# EAGLE schematic midi2cv (EAGLE 6.5.0)
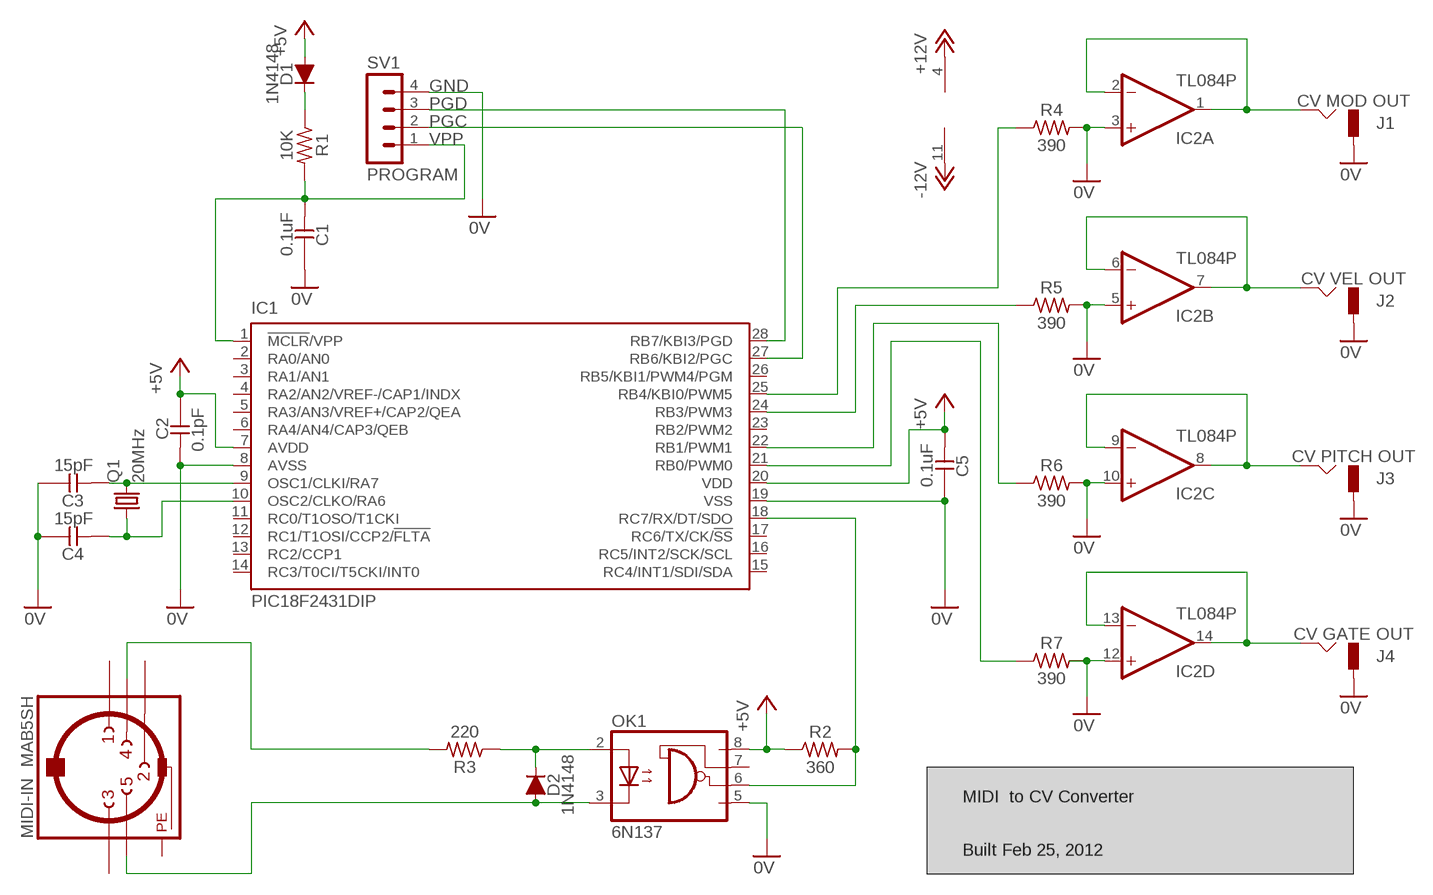
[diagram p0: schematic, sheet 1]

## Parts
C1  0.1uF  CC-US025-024X044  [C025-024X044]
C2  0.1pF  CC-US025-024X044  [C025-024X044]
C3  15pF  CC-US025-024X044  [C025-024X044]
C4  15pF  CC-US025-024X044  [C025-024X044]
C5  0.1uF  CC-US025-024X044  [C025-024X044]
D1  1N4148  [DO35-7]
D2  1N4148  [DO35-7]
IC1  PIC18F2431DIP  [DIL28-3]
IC2  TL084P  [DIL14]
J1  CV MOD OUT  JACK-M  [JACK-M]
J2  CV VEL OUT  JACK-M  [JACK-M]
J3  CV PITCH OUT  JACK-M  [JACK-M]
J4  CV GATE OUT  JACK-M  [JACK-M]
MIDI-IN  MAB5SH  [MAB5SH]
OK1  6N137  [DIL08]
Q1  20MHz  CRYSTALHC49S  [HC49/S]
R1  10K  R0309/10  [0309/10]
R2  360  R0309/10  [0309/10]
R3  220  R0309/10  [0309/10]
R4  390  R0309/10  [0309/10]
R5  390  R0309/10  [0309/10]
R6  390  R0309/10  [0309/10]
R7  390  R0309/10  [0309/10]
SV1  PROGRAM  MA04-1  [MA04-1]

## Nets
0V: C1.1 C2.2 C3.1 C4.1 C5.1 IC1.8(AVSS) IC1.19(VSS) IC2.3(A:+IN) IC2.5(B:+IN) IC2.10(C:+IN) IC2.12(D:+IN) J1.GND J2.GND J3.GND J4.GND OK1.5(GND) R4.2 R5.2 R6.2 R7.2
+5V: C2.1 C5.2 D1.A IC1.7(AVDD) IC1.20(VDD) OK1.8(VCC) R2.1
+12V: IC2.4(P:V+)
-12V: IC2.11(P:V-)
GND: SV1.4 ; supply symbol labelled 0V
N$1: D1.C R1.1
N$2: IC2.1(A:OUT) IC2.2(A:-IN) J1.HOT
N$3: IC2.6(B:-IN) IC2.7(B:OUT) J2.HOT
N$4: IC2.8(C:OUT) IC2.9(C:-IN) J3.HOT
N$5: C3.2 IC1.9(OSC1/CLKI/RA7) Q1.2
N$6: C4.2 Q1.1
N$7: IC2.13(D:-IN) IC2.14(D:OUT) J4.HOT
N$9: MIDI-IN.4 R3.2
N$10: D2.A MIDI-IN.5 OK1.3(C)
N$11: D2.C OK1.2(A) R3.1
N$13: OK1.6(VO) R2.2
N$16: IC1.25(RB4/KBI0/PWM5) R4.1
N$17: IC1.24(RB3/PWM3) R5.1
N$18: IC1.22(RB1/PWM1) R6.1
N$19: IC1.21(RB0/PWM0) R7.1
PGC: SV1.2
PGD: IC1.28(RB7/KBI3/PGD) SV1.3
VPP: C1.2 IC1.1(!MCLR!/VPP) R1.2 SV1.1
Unconnected: IC1.2(RA0/AN0) IC1.3(RA1/AN1) IC1.4(RA2/AN2/VREF-/CAP1/INDX) IC1.5(RA3/AN3/VREF+/CAP2/QEA) IC1.6(RA4/AN4/CAP3/QEB) IC1.10(OSC2/CLKO/RA6) IC1.11(RC0/T1OSO/T1CKI) IC1.12(RC1/T1OSI/CCP2/!FLTA) IC1.13(RC2/CCP1) IC1.14(RC3/T0CI/T5CKI/INT0) IC1.15(RC4/INT1/SDI/SDA) IC1.16(RC5/INT2/SCK/SCL) IC1.17(RC6/TX/CK/!SS) IC1.18(RC7/RX/DT/SDO) IC1.23(RB2/PWM2) IC1.26(RB5/KBI1/PWM4/PGM) IC1.27(RB6/KBI2/PGC) MIDI-IN.1 MIDI-IN.2 MIDI-IN.3 OK1.7(VE)

## Notes on the sheet
- MIDI  to CV Converter
- Built Feb 25, 2012

## Power pins joined to a net without a drawn wire
PE: MIDI-IN.PE MIDI-IN.PE@(PE)

## Library data of the parts
C1-C5 = _common:CC-US: CAPACITOR, US symbol
D1 D2 = _common:1N4148: DIODE high speed (Philips)
IC1 = _common:PIC18F2*31: USB Microcontrollers with nanoWatt Technology High-Performance, Enhanced Flash, 28-Pin, Source: http://ww1.microchip.com/downloads/en/devicedoc/39616d.pdf; MF: MICROCHIP; MPN: PIC18F2431-I/SP
IC2 = _common:TL084: OP AMP
J1-J4 = _common:JACK-M
MIDI-IN = con-hirschmann:MAB5SH: Female CONNECTOR 5 pins 90 deg. with shield, horizontal (DIN 41524); OC_FARNELL: 809883; OC_NEWARK: unknown
OK1 = optocoupler:6N137: MOTOROLA OPTO COUPLER; MPN: 6N137; OC_FARNELL: 1328376; OC_NEWARK: 52M1895
Q1 = crystal:CRYSTAL: CRYSTAL; OC_FARNELL: 1667008; OC_NEWARK: unknown
R1-R7 = _common:R: RESISTOR, US symbol
SV1 = con-lstb:MA04-1: PIN HEADER; OC_FARNELL: unknown; OC_NEWARK: unknown